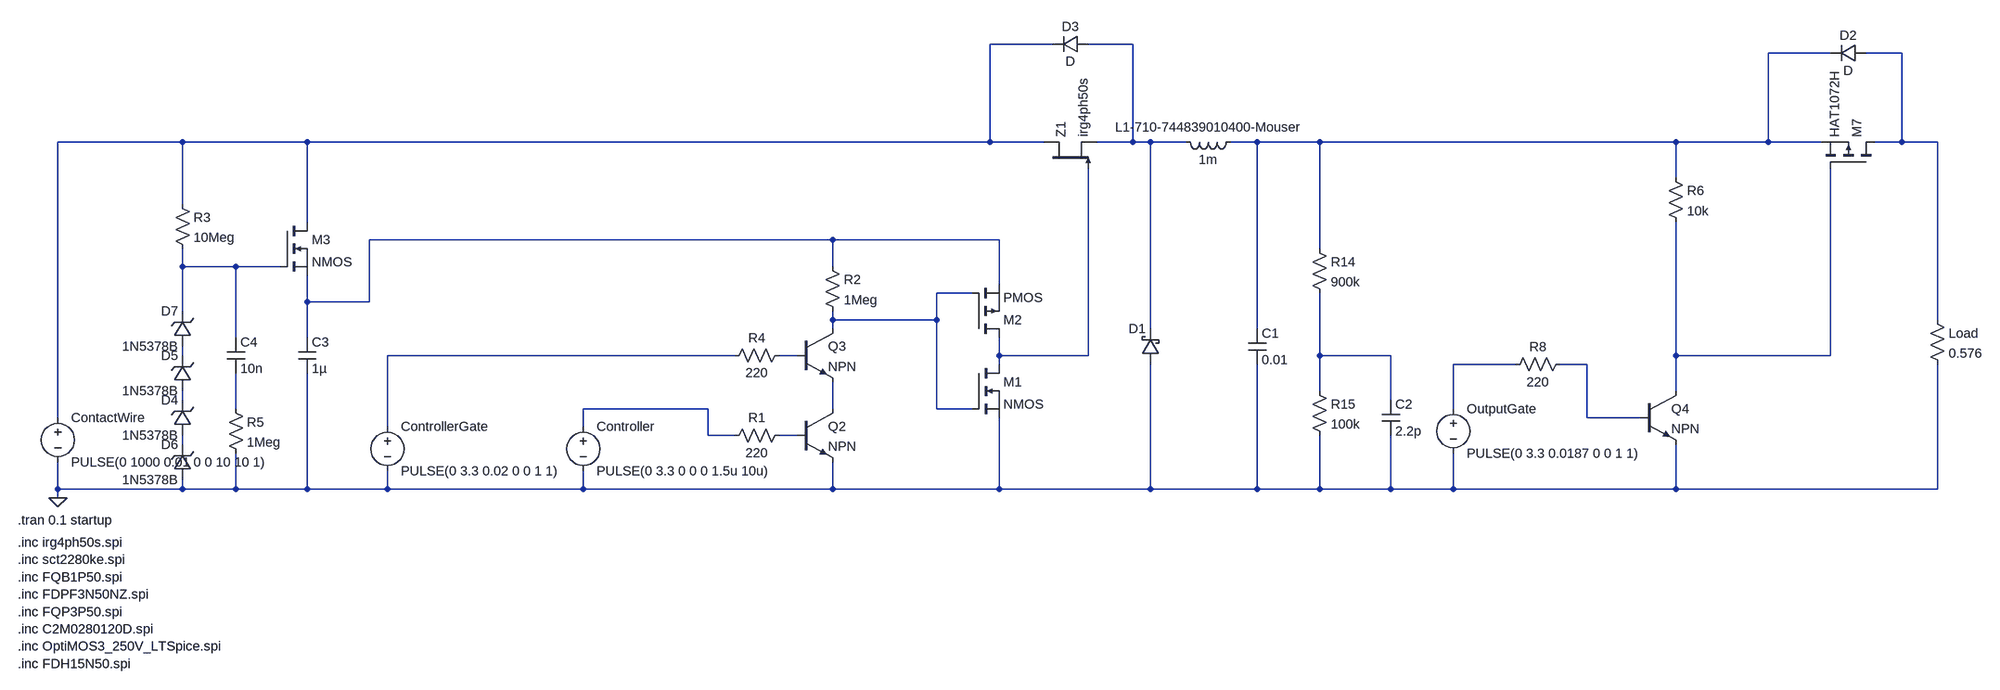
[diagram p0: schematic dc_dc_converter.asc]
dc_dc_converter.asc, the LTspice schematic file:
Version 4
SHEET 1 6840 1148
WIRE 5056 -608 4944 -608
WIRE 5200 -608 5120 -608
WIRE 6464 -592 6352 -592
WIRE 6592 -592 6528 -592
WIRE 2848 -432 2624 -432
WIRE 3072 -432 2848 -432
WIRE 4944 -432 4944 -608
WIRE 4944 -432 3072 -432
WIRE 5040 -432 4944 -432
WIRE 5200 -432 5200 -608
WIRE 5200 -432 5136 -432
WIRE 5232 -432 5200 -432
WIRE 5296 -432 5232 -432
WIRE 5424 -432 5376 -432
WIRE 5536 -432 5424 -432
WIRE 6176 -432 5536 -432
WIRE 6352 -432 6352 -592
WIRE 6352 -432 6176 -432
WIRE 6448 -432 6352 -432
WIRE 6592 -432 6592 -592
WIRE 6592 -432 6544 -432
WIRE 6656 -432 6592 -432
WIRE 6176 -368 6176 -432
WIRE 2848 -320 2848 -432
WIRE 3072 -288 3072 -432
WIRE 4016 -256 3184 -256
WIRE 4960 -256 4016 -256
WIRE 5536 -240 5536 -432
WIRE 2848 -208 2848 -240
WIRE 2944 -208 2848 -208
WIRE 3024 -208 2944 -208
WIRE 4016 -208 4016 -256
WIRE 4960 -176 4960 -256
WIRE 4912 -160 4848 -160
WIRE 3072 -144 3072 -192
WIRE 3184 -144 3184 -256
WIRE 3184 -144 3072 -144
WIRE 2848 -128 2848 -208
WIRE 4016 -112 4016 -128
WIRE 4848 -112 4848 -160
WIRE 4848 -112 4016 -112
WIRE 6656 -112 6656 -432
WIRE 4016 -96 4016 -112
WIRE 5232 -96 5232 -432
WIRE 5424 -96 5424 -432
WIRE 2944 -80 2944 -208
WIRE 3072 -80 3072 -144
WIRE 2848 -48 2848 -64
WIRE 3840 -48 3216 -48
WIRE 3952 -48 3920 -48
WIRE 4960 -48 4960 -80
WIRE 5120 -48 5120 -384
WIRE 5120 -48 4960 -48
WIRE 5536 -48 5536 -160
WIRE 5664 -48 5536 -48
WIRE 6176 -48 6176 -288
WIRE 6464 -48 6464 -384
WIRE 6464 -48 6176 -48
WIRE 4960 -32 4960 -48
WIRE 5888 -32 5776 -32
WIRE 6016 -32 5968 -32
WIRE 5536 16 5536 -48
WIRE 6176 16 6176 -48
WIRE 2848 32 2848 16
WIRE 5664 32 5664 -48
WIRE 2944 48 2944 -16
WIRE 3792 48 3568 48
WIRE 4016 48 4016 0
WIRE 4848 48 4848 -112
WIRE 4912 48 4848 48
WIRE 5776 48 5776 -32
WIRE 2624 64 2624 -432
WIRE 6016 64 6016 -32
WIRE 6112 64 6016 64
WIRE 3216 80 3216 -48
WIRE 3568 80 3568 48
WIRE 3792 96 3792 48
WIRE 3840 96 3792 96
WIRE 3952 96 3920 96
WIRE 2848 112 2848 96
WIRE 2624 192 2624 144
WIRE 2848 192 2848 176
WIRE 2848 192 2624 192
WIRE 2944 192 2944 128
WIRE 2944 192 2848 192
WIRE 3072 192 3072 -16
WIRE 3072 192 2944 192
WIRE 3216 192 3216 160
WIRE 3216 192 3072 192
WIRE 3568 192 3568 160
WIRE 3568 192 3216 192
WIRE 4016 192 4016 144
WIRE 4016 192 3568 192
WIRE 4960 192 4960 64
WIRE 4960 192 4016 192
WIRE 5232 192 5232 -32
WIRE 5232 192 4960 192
WIRE 5424 192 5424 -32
WIRE 5424 192 5232 192
WIRE 5536 192 5536 96
WIRE 5536 192 5424 192
WIRE 5664 192 5664 96
WIRE 5664 192 5536 192
WIRE 5776 192 5776 128
WIRE 5776 192 5664 192
WIRE 6176 192 6176 112
WIRE 6176 192 5776 192
WIRE 6656 192 6656 -32
WIRE 6656 192 6176 192
WIRE 2624 208 2624 192
FLAG 2624 208 0
SYMBOL voltage 2624 48 R0
WINDOW 123 0 0 Left 0
WINDOW 39 0 0 Left 0
SYMATTR InstName ContactWire
SYMATTR Value PULSE(0 1000 0.01 0 0 10 10 1)
SYMBOL Misc\\NIGBT 5040 -384 R270
SYMATTR InstName Z1
SYMATTR Value irg4ph50s
SYMATTR Prefix X
SYMBOL ind 5392 -448 R90
WINDOW 0 5 56 VBottom 2
WINDOW 3 32 56 VTop 2
SYMATTR InstName L1-710-744839010400-Mouser
SYMATTR Value 1m
SYMATTR SpiceLine Rser=2.1m
SYMBOL schottky 5248 -32 R180
WINDOW 0 24 64 Left 2
WINDOW 3 24 0 Invisible 2
SYMATTR InstName D1
SYMATTR Value RBR30T60A
SYMATTR Description Diode
SYMATTR Type diode
SYMBOL res 6640 -128 R0
SYMATTR InstName Load
SYMATTR Value 0.576
SYMBOL voltage 3568 64 R0
WINDOW 123 0 0 Left 0
WINDOW 39 0 0 Left 0
SYMATTR InstName Controller
SYMATTR Value PULSE(0 3.3 0 0 0 1.5u 10u)
SYMBOL cap 5408 -96 R0
SYMATTR InstName C1
SYMATTR Value 0.01
SYMATTR SpiceLine Rser=20m
SYMBOL nmos 4912 -32 R0
SYMATTR InstName M1
SYMBOL pmos 4912 -80 M180
SYMATTR InstName M2
SYMBOL res 5520 -256 R0
SYMATTR InstName R14
SYMATTR Value 900k
SYMBOL res 5520 0 R0
SYMATTR InstName R15
SYMATTR Value 100k
SYMBOL npn 3952 48 R0
SYMATTR InstName Q2
SYMBOL npn 3952 -96 R0
SYMATTR InstName Q3
SYMBOL res 4000 -224 R0
SYMATTR InstName R2
SYMATTR Value 1Meg
SYMBOL voltage 3216 64 R0
WINDOW 123 0 0 Left 0
WINDOW 39 0 0 Left 0
SYMATTR InstName ControllerGate
SYMATTR Value PULSE(0 3.3 0.02 0 0 1 1)
SYMBOL res 3936 80 R90
WINDOW 0 0 56 VBottom 2
WINDOW 3 32 56 VTop 2
SYMATTR InstName R1
SYMATTR Value 220
SYMBOL res 3936 -64 R90
WINDOW 0 0 56 VBottom 2
WINDOW 3 32 56 VTop 2
SYMATTR InstName R4
SYMATTR Value 220
SYMBOL voltage 5776 32 R0
WINDOW 123 0 0 Left 0
WINDOW 39 0 0 Left 0
SYMATTR InstName OutputGate
SYMATTR Value PULSE(0 3.3 0.0187 0 0 1 1)
SYMBOL npn 6112 16 R0
SYMATTR InstName Q4
SYMBOL res 6160 -384 R0
SYMATTR InstName R6
SYMATTR Value 10k
SYMBOL res 5984 -48 R90
WINDOW 0 0 56 VBottom 2
WINDOW 3 32 56 VTop 2
SYMATTR InstName R8
SYMATTR Value 220
SYMBOL pmos 6544 -384 M270
SYMATTR InstName M7
SYMATTR Value HAT1072H
SYMBOL cap 5648 32 R0
SYMATTR InstName C2
SYMATTR Value 2.2p
SYMBOL diode 6528 -608 R90
WINDOW 0 0 32 VBottom 2
WINDOW 3 32 32 VTop 2
SYMATTR InstName D2
SYMBOL diode 5120 -624 R90
WINDOW 0 0 32 VBottom 2
WINDOW 3 32 32 VTop 2
SYMATTR InstName D3
SYMBOL zener 2864 96 R180
WINDOW 0 24 64 Left 2
WINDOW 3 24 0 Left 2
SYMATTR InstName D4
SYMATTR Value 1N5378B
SYMATTR Description Diode
SYMATTR Type diode
SYMBOL zener 2864 16 R180
WINDOW 0 24 64 Left 2
WINDOW 3 24 0 Left 2
SYMATTR InstName D5
SYMATTR Value 1N5378B
SYMATTR Description Diode
SYMATTR Type diode
SYMBOL zener 2864 176 R180
WINDOW 0 24 64 Left 2
WINDOW 3 24 0 Left 2
SYMATTR InstName D6
SYMATTR Value 1N5378B
SYMATTR Description Diode
SYMATTR Type diode
SYMBOL zener 2864 -64 R180
WINDOW 0 24 64 Left 2
WINDOW 3 24 0 Left 2
SYMATTR InstName D7
SYMATTR Value 1N5378B
SYMATTR Description Diode
SYMATTR Type diode
SYMBOL res 2832 -336 R0
SYMATTR InstName R3
SYMATTR Value 10Meg
SYMBOL nmos 3024 -288 R0
SYMATTR InstName M3
SYMBOL cap 3056 -80 R0
SYMATTR InstName C3
SYMATTR Value 1µ
SYMBOL cap 2928 -80 R0
SYMATTR InstName C4
SYMATTR Value 10n
SYMBOL res 2928 32 R0
SYMATTR InstName R5
SYMATTR Value 1Meg
TEXT 2552 248 Left 2 !.tran 0.1 startup
TEXT 2552 288 Left 2 !.inc irg4ph50s.spi\n.inc sct2280ke.spi\n.inc FQB1P50.spi\n.inc FDPF3N50NZ.spi\n.inc FQP3P50.spi\n.inc C2M0280120D.spi\n.inc OptiMOS3_250V_LTSpice.spi\n.inc FDH15N50.spi

The netlist it stands for:
* dc_dc_converter.asc
V§ContactWire N001 0 PULSE(0 1000 0.01 0 0 10 10 1)
XZ1 N001 N011 N002 irg4ph50s  ; pins C G E
L1-710-744839010400-Mouser N003 N002 1m Rser=2.1m
D1 0 N002 RBR30T60A
R§Load N004 0 0.576
V§Controller N018 0 PULSE(0 3.3 0 0 0 1.5u 10u)
C1 N003 0 0.01 Rser=20m
M1 N011 N007 0 0 NMOS
M2 N011 N007 N005 N005 PMOS
R14 N003 N012 900k
R15 N012 0 100k
Q2 N019 N020 0 0 NPN
Q3 N007 N010 N019 0 NPN
R2 N005 N007 1Meg
V§ControllerGate N009 0 PULSE(0 3.3 0.02 0 0 1 1)
R1 N020 N018 220
R4 N010 N009 220
V§OutputGate N014 0 PULSE(0 3.3 0.0187 0 0 1 1)
Q4 N013 N015 0 0 NPN
R6 N003 N013 10k
R8 N015 N014 220
M7 N004 N013 N003 N003 HAT1072H
C2 N012 0 2.2p
D2 N004 N003 D
D3 N002 N001 D
D4 N021 N016 1N5378B
D5 N016 N008 1N5378B
D6 0 N021 1N5378B
D7 N008 N006 1N5378B
R3 N001 N006 10Meg
M3 N001 N006 N005 N005 NMOS
C3 N005 0 1µ
C4 N006 N017 10n
R5 N017 0 1Meg
.model D D
.lib standard.dio
.model NPN NPN
.model PNP PNP
.lib standard.bjt
.model NMOS NMOS
.model PMOS PMOS
.lib standard.mos
.tran 0.1 startup
.inc irg4ph50s.spi
.inc sct2280ke.spi
.inc FQB1P50.spi
.inc FDPF3N50NZ.spi
.inc FQP3P50.spi
.inc C2M0280120D.spi
.inc OptiMOS3_250V_LTSpice.spi
.inc FDH15N50.spi
.backanno
.end